# EAGLE design Main (EAGLE 9.6.0)
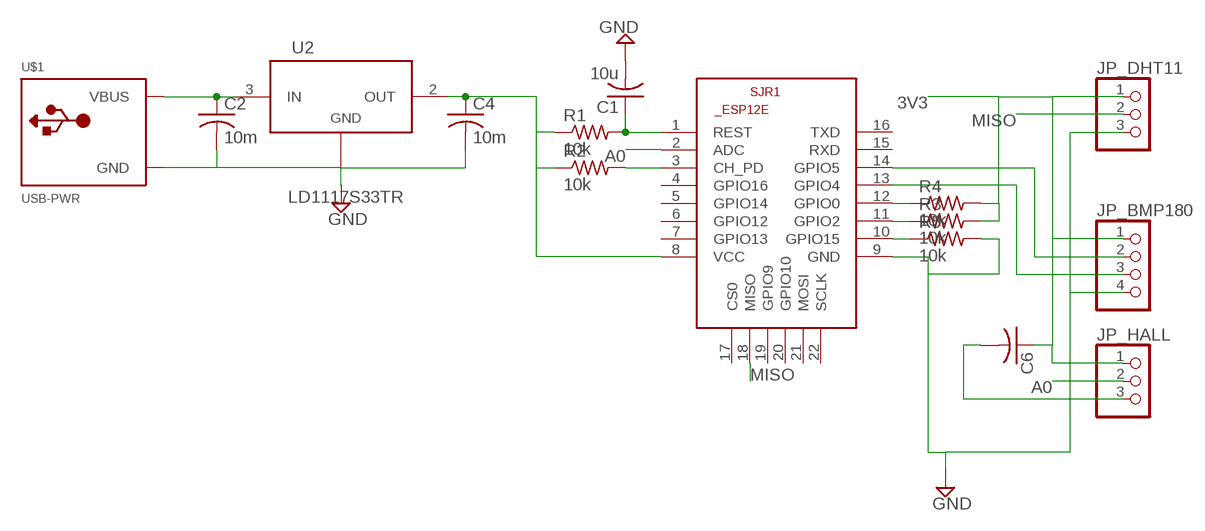
[diagram p0: schematic, sheet 1]

## Parts
C1  10u  C-USC0805  [C0805]
C2  10m  C-USC0805  [C0805]
C4  10m  C-USC0805  [C0805]
C6  C-USC0805  [C0805]
JP_BMP180  PINHD-1X4/90  [1X04/90]
JP_DHT11  PINHD-1X3/90  [1X03/90]
JP_HALL  PINHD-1X3/90  [1X03/90]
R1  10k  R-US_M1406  [M1406]
R2  10k  R-US_M1406  [M1406]
R3  10k  R-US_M1406  [M1406]
R4  10k  R-US_M1406  [M1406]
R5  10k  R-US_M1406  [M1406]
SJR1  ESP8266-12EESP12E  [ESP8266-ESP12E]
U2  LD1117S33TR  [SOT-223]
U$1  USB-PWR  [USB-MINIB-THM-MOLEX-PWRONLY]

## Nets
3V3: C4.1 C6.1 JP_BMP180.1 JP_DHT11.1 JP_HALL.1 R1.1 R2.1 R3.2 R4.2 SJR1.8(VCC) U2.2(OUT) U2.4
A0: JP_HALL.2 SJR1.2(ADC)
GND: C1.2 C2.2 C4.2 C6.2 JP_BMP180.4 JP_DHT11.3 JP_HALL.3 R5.2 SJR1.9(GND) U2.1(ADJ/GND) U$1.GND
MISO: JP_DHT11.2 SJR1.18(MISO)
N$1: C2.1 U2.3(IN) U$1.VBUS
N$2: R2.2 SJR1.3(CH_PD)
N$3: C1.1 R1.2 SJR1.1(REST)
N$4: R4.1 SJR1.12(GPIO0)
N$5: R3.1 SJR1.11(GPIO2)
N$6: R5.1 SJR1.10(GPIO15)
N$8: JP_BMP180.3 SJR1.13(GPIO4)
N$9: JP_BMP180.2 SJR1.14(GPIO5)
Unconnected: SJR1.4(GPIO16) SJR1.5(GPIO14) SJR1.6(GPIO12) SJR1.7(GPIO13) SJR1.15(RXD) SJR1.16(TXD) SJR1.17(CS0) SJR1.19(GPIO9) SJR1.20(GPIO10) SJR1.21(MOSI) SJR1.22(SCLK)

## Library data of the parts
C1 C2 C4 C6 = adafruit:C-US: CAPACITOR, American symbol
JP_BMP180 = pinhead:PINHD-1X4: PIN HEADER
JP_DHT11 JP_HALL = pinhead:PINHD-1X3: PIN HEADER
R1-R5 = adafruit:R-US_: RESISTOR, American symbol
SJR1 = esp12e:ESP8266-12E: ESP8266-12E Library for Eagle CAD The author not responsible for any damages or errors!. Created by Suhail jr.lt;/author>
U2 = IC:LD1117S33TR: IC REG LINEAR 3.3V 800MA SOT223 Manufacturer's datasheet <http://www.st.com/content/ccc/resource/technical/document/datasheet/99/3b/7d/91/91/51/4b/be/CD00000544.pdf/files/CD00000544.pdf/jcr:content/translations/en.CD00000544.pdf>; CREATED_BY: PCBLayout.com; DIGIKEY_PART_NUMBER: 497-1242-2-ND; MANUFACTURER: STMicroelectronics; MPN: LD1117S33TR; PACKAGE: SOT-223
U$1 = adafruit:USB-PWR

## Board
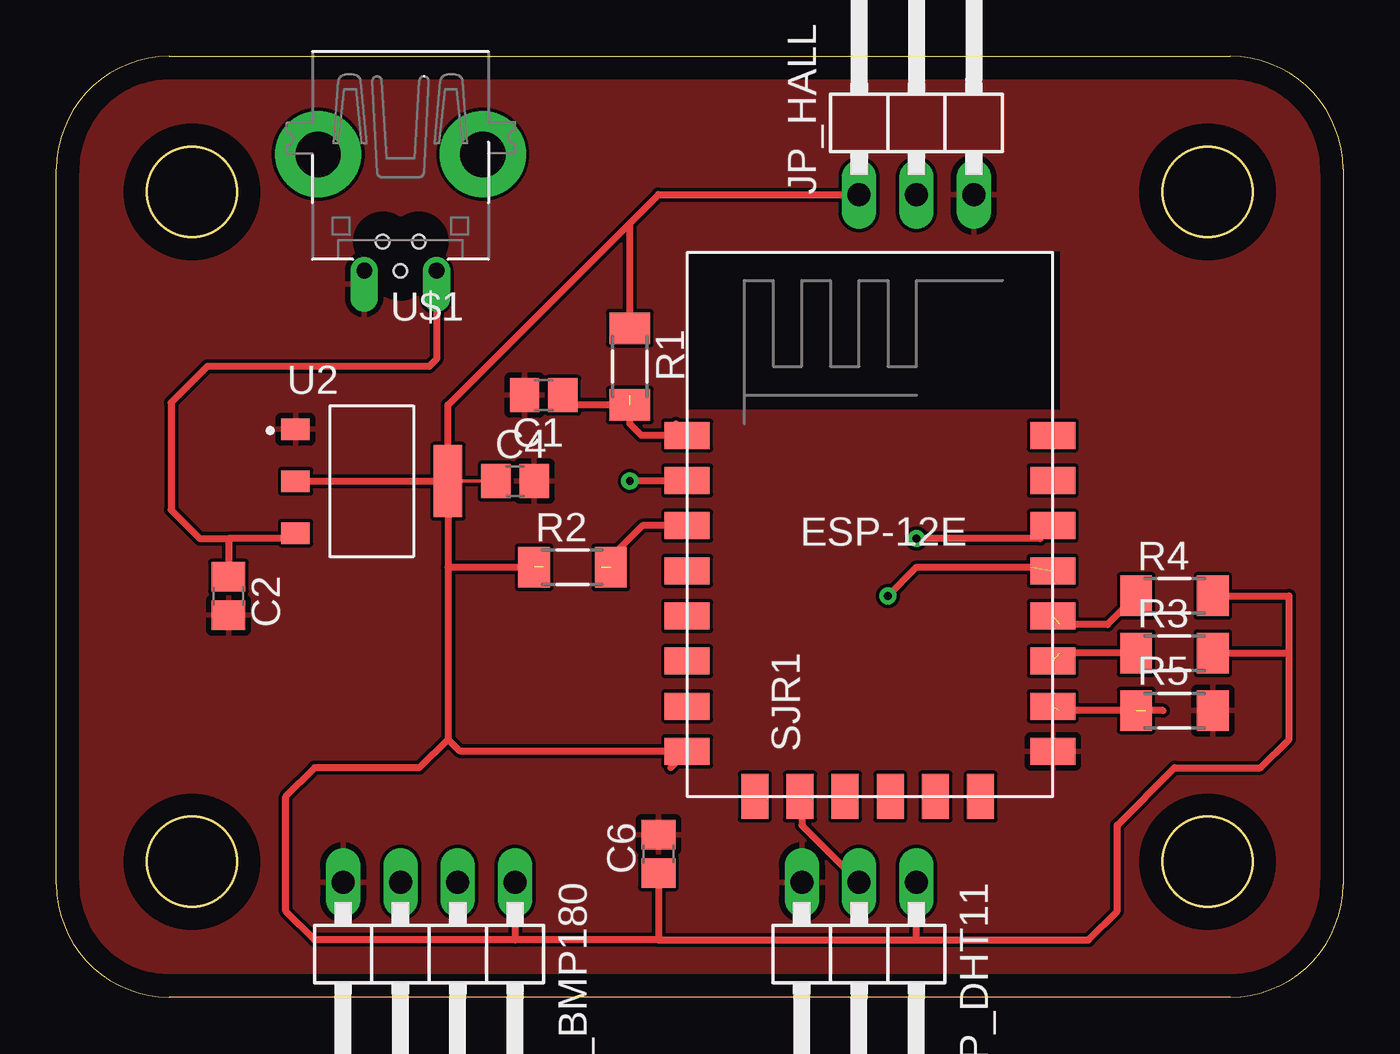
[diagram p1: board, top side]
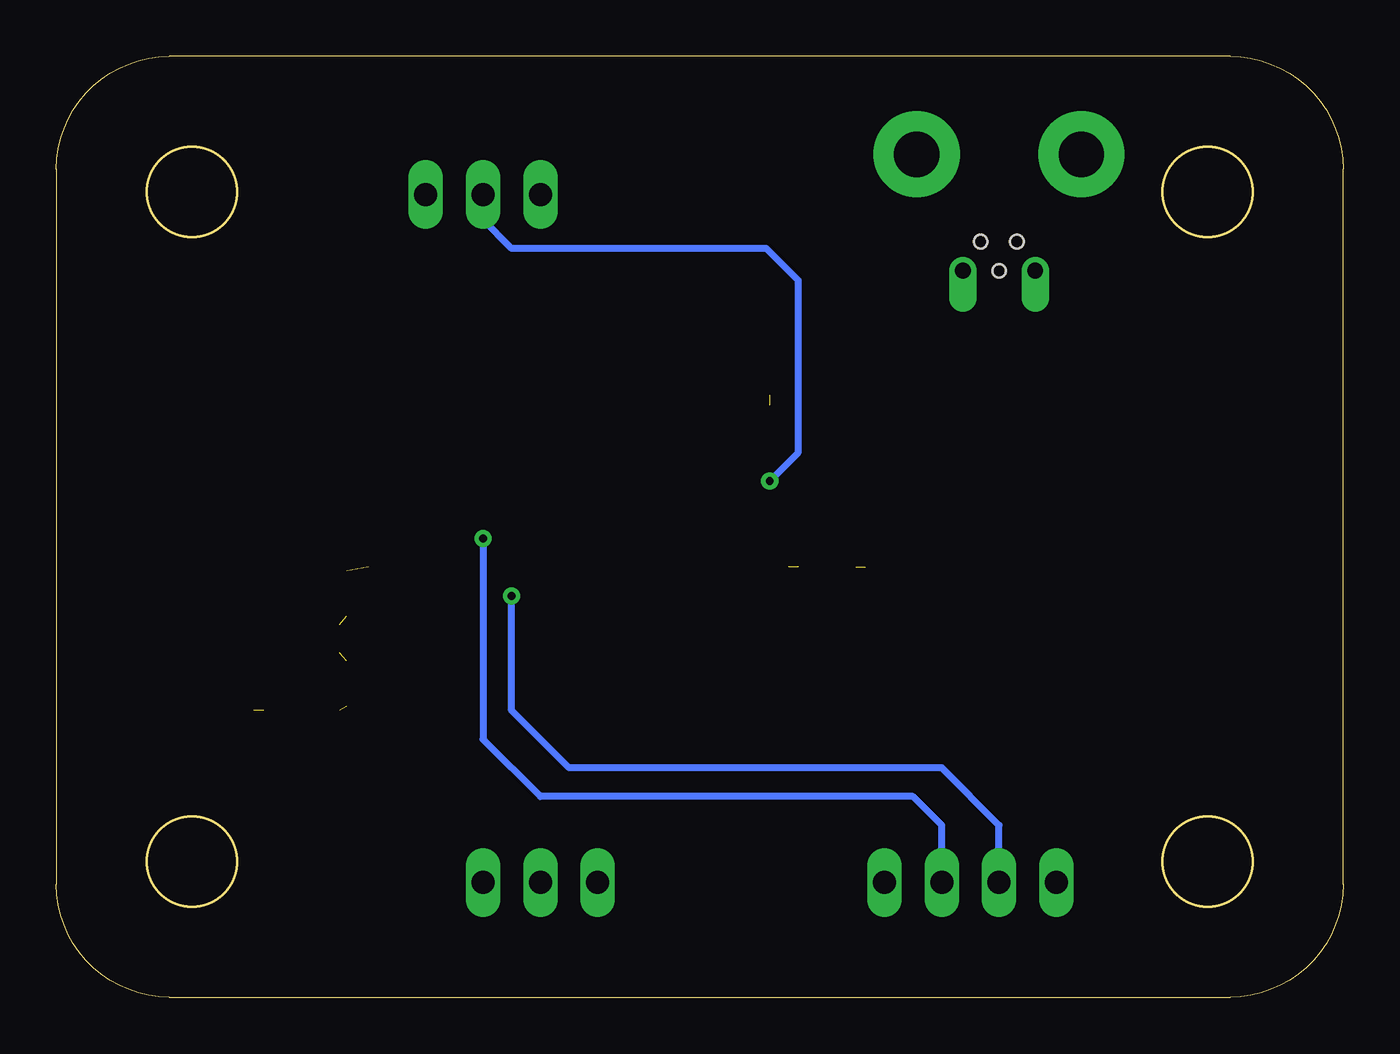
[diagram p2: board, bottom side, seen from below]

Size 57 x 41.68 mm. Coordinates in mm from the lower left corner, seen from the top.
Outline: 52,0 arc90 57,5 57,36.68 arc90 52,41.68 5,41.68 arc90 0,36.68 0,5 arc90 5,0 52,0
Outline: circle at 51,6 radius 2
Outline: circle at 6,35.68 radius 2
Outline: circle at 6,6 radius 2
Outline: circle at 51,35.68 radius 2
Copper layers (1*16): Top 0.035mm / dielectric 1.5mm / Bottom 0.035mm
Design rules "default": minimum track width 6mil, minimum drill 0.35mm, track to track 6mil, track to pad 6mil, pad to pad 6mil, via to via 6mil, smd to smd 6mil, copper to edge 40mil, drill to drill 6mil, minimum pad ring 10mil, minimum via ring 8mil, stop-mask expansion 4mil, vias tented up to drill 0mil, thermal gap 10mil

### Footprints (pad centres in the part's own frame; a part is rotated, then mirrored left to right if it is on the bottom)
C0805 = smd 1.3 x 1.5: 1 -0.85,0; 2 0.85,0
1X04/90 = drill 1.016 long: 1 -3.81,-3.81; 2 -1.27,-3.81; 3 1.27,-3.81; 4 3.81,-3.81
1X03/90 = drill 1.016 long: 1 -2.54,-3.81; 2 0,-3.81; 3 2.54,-3.81
M1406 = smd 1.4 x 1.8: 1 -1.7,0; 2 1.7,0
ESP8266-ESP12E = smd 2 x 1.2: 1 -7.62,5.84; 2 -7.62,3.84; 3 -7.62,1.84; 4 -7.62,-0.16; 5 -7.62,-2.16; 6 -7.62,-4.16; 7 -7.62,-6.16; 8 -7.62,-8.16; 9 8.58,-8.16; 10 8.58,-6.16; 11 8.58,-4.16; 12 8.58,-2.16; 13 8.58,-0.16; 14 8.58,1.84; 15 8.58,3.84; 16 8.58,5.84 | smd 1.2 x 2: 17 -4.62,-10.16; 18 -2.62,-10.16; 19 -0.62,-10.16; 20 1.38,-10.16; 21 3.38,-10.16; 22 5.38,-10.16
SOT-223 = smd 1.26 x 0.96: 1 -3.375,2.3; 2 -3.375,0; 3 -3.375,-2.3 | smd 1.26 x 3.19: 4 3.375,0
USB-MINIB-THM-MOLEX-PWRONLY = drill 0.7 offset: GND 1.6,4.64; VBUS -1.6,4.64 | drill 2 pad 3.81: GND1 -3.65,-0.51; GND4 3.65,-0.51 | hole 0.6: 0,4.648; 0.787,3.353; -0.813,3.353

### Placement (x,y rotation side)
C1  21.59,26.67 180 top
C2  7.62,17.78 270 top
C4  20.32,22.86 0 top
C6  26.67,6.35 90 top
JP_BMP180  16.51,1.27 180 top
JP_DHT11  35.56,1.27 180 top
JP_HALL  38.1,39.37 0 top
R1  25.4,27.94 270 top
R2  22.86,19.05 0 top
R3  49.53,15.24 0 top
R4  49.53,17.78 0 top
R5  49.53,12.7 0 top
SJR1  35.56,19.05 0 top
U2  13.97,22.86 0 top
U$1  15.24,36.83 180 top

### Tracks (layer width: path | path; a pad name or v marks a point on that pad's centre or on a via)
3V3  (1 unrouted)
  Top 0.152: 17.78,22.86 U2.4 C4.1
  Top 0.305: U2.2 U2.4 | 38.1,2.54 JP_DHT11.1 | U2.4 17.34,26.23 25.4,34.29 | 25.4,34.29 26.67,35.56 JP_HALL.1 | R1.1 25.4,34.29 | R4.2 54.61,17.78 54.61,15.24 | 26.67,2.54 38.1,2.54 | 26.67,2.54 20.32,2.54 | 20.32,2.54 11.43,2.54 10.16,3.81 10.16,8.89 11.43,10.16 16.07,10.16 17.34,11.43 | R3.2 54.61,15.24 | U2.4 17.34,19.05 | 17.34,19.05 17.34,11.43 | 17.34,19.05 21.59,19.05 | 27.21,10.16 SJR1.8 17.89,10.89 17.34,11.43 | 54.61,15.24 54.61,11.43 53.34,10.16 49.53,10.16 46.99,7.62 46.99,3.81 45.72,2.54 38.1,2.54 | C6.1 26.67,2.54 | JP_BMP180.1 20.32,2.54
A0  (via drill 0.35)
  Top 0.305: SJR1.2 27.91,22.86 v25.4,22.86
  Bottom 0.305: v25.4,22.86 24.13,24.13 24.13,31.75 25.55,33.17 36.83,33.17 38.1,34.44 JP_HALL.2
GND
  pour Top: 0,0 0,0 0,41.91 57.15,41.91 57.15,0
MISO
  Top 0.305: SJR1.18 33.02,8.81 33.02,7.62 JP_DHT11.2
N$1
  Top 0.305: U$1.VBUS 16.84,28.27 16.51,27.94 6.68,27.94 5.08,26.34 5.08,21.59 6.35,20.32 7.62,20.32 | 7.62,20.32 C2.1 | U2.3 10.36,20.32 7.62,20.32
N$2  (1 unrouted)
  Top 0.305: SJR1.3 25.97,20.89 24.13,19.05
N$3  (1 unrouted)
  Top 0.305: R1.2 22.87,26.24 C1.1 | 27.43,25.4 SJR1.1 25.91,24.89 25.4,25.4 25.4,26.67
N$4  (1 unrouted)
  Top 0.305: 48.26,17.78 R4.1 46.56,16.51 44.45,16.51
N$5  (1 unrouted)
  Top 0.305: R3.1 44.45,15.24
N$6  (2 unrouted)
  Top 0.305: 49.03,12.7 48.26,12.7 | R5.1 44.45,12.7
N$8  (via drill 0.35)  (1 unrouted)
  Top 0.305: v36.83,17.78 38.1,19.05 43.18,19.05
  Bottom 0.305: JP_BMP180.3 15.24,7.62 17.78,10.16 34.29,10.16 36.83,12.7 v36.83,17.78
N$9  (via drill 0.35)
  Top 0.305: SJR1.14 43.57,20.32 v38.1,20.32
  Bottom 0.305: JP_BMP180.2 17.78,7.62 19.05,8.89 35.56,8.89 38.1,11.43 v38.1,20.32